# EAGLE design DBPIC16f887_V2 (EAGLE 9.6.2)
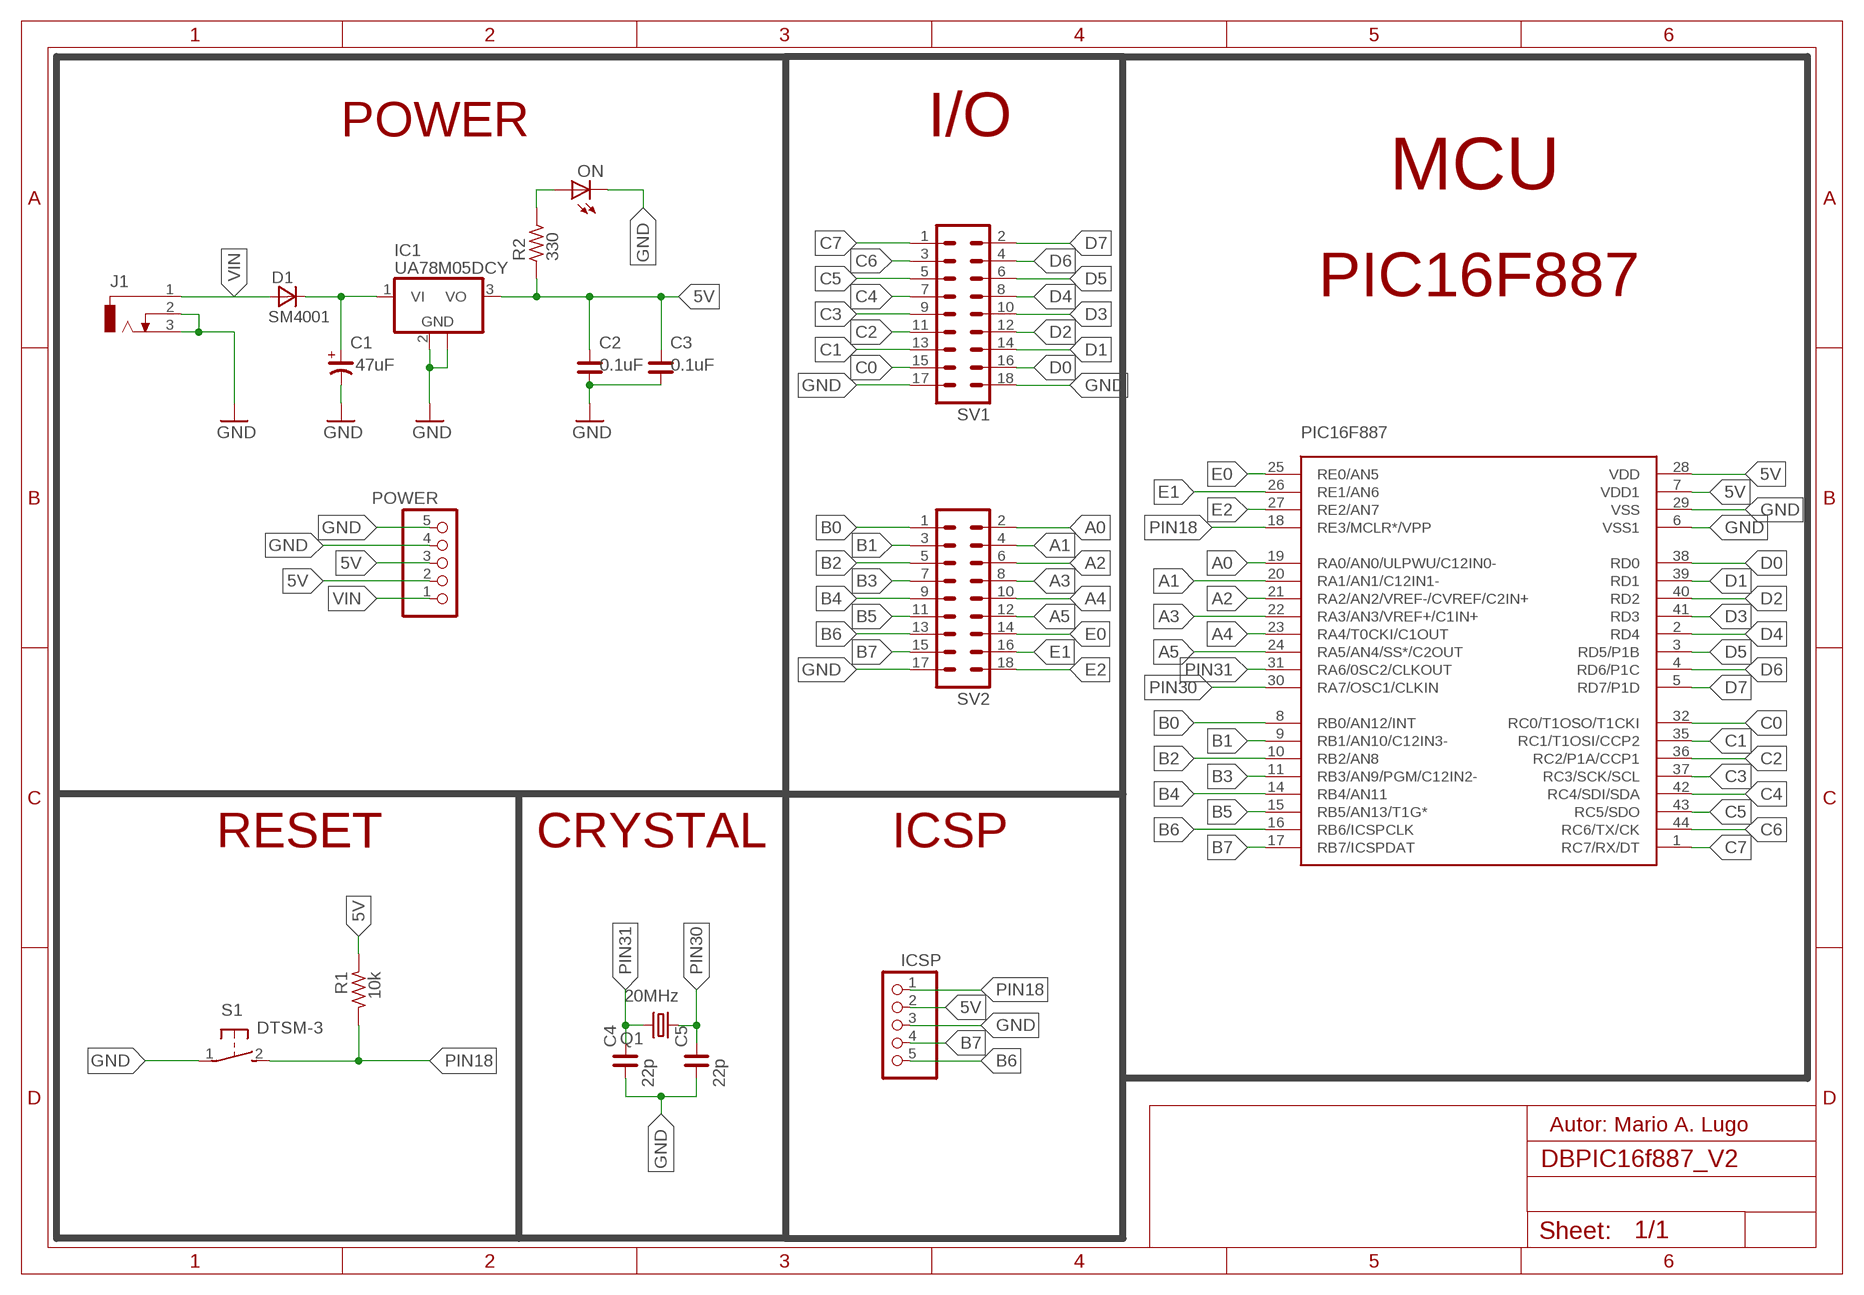
[diagram p0: schematic, sheet 1]

## Parts
C1  47uF  CP_SV-B  [CSV-B]
C2  0.1uF  C_0805  [C0805]
C3  0.1uF  C_0805  [C0805]
C4  22p  C_0805  [C0805]
C5  22p  C_0805  [C0805]
D1  SM4001  [MELF-MLL41]
IC1  UA78M05DCY  [SOT223]
ICSP  PINHD-1X5  [1X05]
J1  DCJ0303  [DCJ0303]
MCU  PIC16F887  [TQFP44]
ON  LEDCHIPLED_0805  [CHIPLED_0805]
POWER  PINHD-1X5  [1X05]
Q1  20MHz  CSM-7X-DU  [CSM-7X-DU]
R1  10k  R_0805  [R0805]
R2  330  R_0805  [R0805]
S1  DTSM-3  [DTSM-3]
SV1  MA09-2  [MA09-2]
SV2  MA09-2  [MA09-2]

## Nets
5V: C2.2 C3.2 IC1.3(VO) ICSP.2 MCU.7(VDD1) MCU.28(VDD) POWER.2 POWER.3 R1.1 R2.1
A0: MCU.19(RA0/AN0/ULPWU/C12IN0-) SV2.2
A1: MCU.20(RA1/AN1/C12IN1-) SV2.4
A2: MCU.21(RA2/AN2/VREF-/CVREF/C2IN+) SV2.6
A3: MCU.22(RA3/AN3/VREF+/C1IN+) SV2.8
A4: MCU.23(RA4/T0CKI/C1OUT) SV2.10
A5: MCU.24(RA5/AN4/SS*/C2OUT) SV2.12
B0: MCU.8(RB0/AN12/INT) SV2.1
B1: MCU.9(RB1/AN10/C12IN3-) SV2.3
B2: MCU.10(RB2/AN8) SV2.5
B3: MCU.11(RB3/AN9/PGM/C12IN2-) SV2.7
B4: MCU.14(RB4/AN11) SV2.9
B5: MCU.15(RB5/AN13/T1G*) SV2.11
B6: ICSP.5 MCU.16(RB6/ICSPCLK) SV2.13
B7: ICSP.4 MCU.17(RB7/ICSPDAT) SV2.15
C0: MCU.32(RC0/T1OSO/T1CKI) SV1.15
C1: MCU.35(RC1/T1OSI/CCP2) SV1.13
C2: MCU.36(RC2/P1A/CCP1) SV1.11
C3: MCU.37(RC3/SCK/SCL) SV1.9
C4: MCU.42(RC4/SDI/SDA) SV1.7
C5: MCU.43(RC5/SDO) SV1.5
C6: MCU.44(RC6/TX/CK) SV1.3
C7: MCU.1(RC7/RX/DT) SV1.1
D0: MCU.38(RD0) SV1.16
D1: MCU.39(RD1) SV1.14
D2: MCU.40(RD2) SV1.12
D3: MCU.41(RD3) SV1.10
D4: MCU.2(RD4) SV1.8
D5: MCU.3(RD5/P1B) SV1.6
D6: MCU.4(RD6/P1C) SV1.4
D7: MCU.5(RD7/P1D) SV1.2
E0: MCU.25(RE0/AN5) SV2.14
E1: MCU.26(RE1/AN6) SV2.16
E2: MCU.27(RE2/AN7) SV2.18
GND: C1.- C2.1 C3.1 C4.1 C5.1 IC1.2(GND) IC1.4(GND) ICSP.3 J1.2 J1.3 MCU.6(VSS1) MCU.29(VSS) ON.C POWER.4 POWER.5 S1.1 SV1.17 SV1.18 SV2.17
LED1: ON.A R2.2
PIN18: ICSP.1 MCU.18(RE3/MCLR*/VPP) R1.2 S1.2
PIN30: C5.2 MCU.30(RA7/OSC1/CLKIN) Q1.1
PIN31: C4.2 MCU.31(RA6/0SC2/CLKOUT) Q1.2
VI: C1.+ D1.C IC1.1(VI)
VIN: D1.A J1.1 POWER.1

## Notes on the sheet
- POWER | I/O
- MCU
- PIC16F887
- RESET | CRYSTAL | ICSP
- Autor: Mario A. Lugo

## Library data of the parts
C1 = rc-master-smd:CP_: POLARIZED CAP
C2-C5 = rc-master-smd:C_: NON-POLARIZED CAP
D1 = _mod_diode:SM400*: SM4001 .. SM4007 General Purpose Rectifier, 1 A SMD-Version of 1N4001 .. 1N4007 Case: MELF-MLL41 = DO 213 AB Author: Dipl.-Ing. FH Rainer Bayer HHN Hochschule Heilbronn, rainer.bayer@hs-heilbronn.de Ingenieurbüro ing-rb, mail@ing-rb.de
IC1 = linear:UA78M*: POSITIVE-VOLTAGE REGULATORS Source: http://focus.ti.com/lit/ds/symlink/ua78m33.pdf
ICSP POWER = pinhead:PINHD-1X5: PIN HEADER
J1 = con-jack:DCJ0303: DC POWER JACK Source: DCJ0303.pdf
MCU = pic16f88x-v0.1:PIC16F887
ON = led:LED: LED OSRAM: - CHIPLED LG R971, LG N971, LY N971, LG Q971, LY Q971, LO R971, LY R971 LH N974, LH R974 LS Q976, LO Q976, LY Q976 LO Q996 - Hyper CHIPLED LW Q18S LB Q993, LB Q99A, LB R99A - SideLED LS A670, LO A670, LY A670, LG A670, LP A670 LB A673, LV A673, LT A673, LW A673 LH A674 LY A675 LS A676, LA A676, LO A676, LY A676, LW A676 LS A679, LY A679, LG A679 - Hyper Micro SIDELED® LS Y876, LA Y876, LO Y876, LY Y876 LT Y87S - SmartLED LW L88C, LW L88S LB L89C, LB L89S, LG L890 LS L89K, LO L89K, LY L89K LS L896, LA L896, LO L896, LY L896 - TOPLED LS T670, LO T670, LY T670, LG T670, LP T670 LSG T670, LSP T670, LSY T670, LOP T670, LYG T670 LG T671, LOG T671, LSG T671 LB T673, LV T673, LT T673, LW T673 LH T674 LS T676, LA T676, LO T676, LY T676, LB T676, LH T676, LSB T676, LW T676 LB T67C, LV T67C, LT T67C, LS T67K, LO T67K, LY T67K, LW E67C LS E67B, LA E67B, LO E67B, LY E67B, LB E67C, LV E67C, LT E67C LW T67C LS T679, LY T679, LG T679 LS T770, LO T770, LY T770, LG T770, LP T770 LB T773, LV T773, LT T773, LW T773 LH T774 LS E675, LA E675, LY E675, LS T675 LS T776, LA T776, LO T776, LY T776, LB T776 LHGB T686 LT T68C, LB T68C - Hyper Mini TOPLED® LB M676 - Mini TOPLED Santana® LG M470 LS M47K, LO M47K, LY M47K Source: http://www.osram.convergy.de LUXEON: - LUMILED® LXK2-PW12-R00, LXK2-PW12-S00, LXK2-PW14-U00, LXK2-PW14-V00 LXK2-PM12-R00, LXK2-PM12-S00, LXK2-PM14-U00 LXK2-PE12-Q00, LXK2-PE12-R00, LXK2-PE12-S00, LXK2-PE14-T00, LXK2-PE14-U00 LXK2-PB12-K00, LXK2-PB12-L00, LXK2-PB12-M00, LXK2-PB14-N00, LXK2-PB14-P00, LXK2-PB14-Q00 LXK2-PR12-L00, LXK2-PR12-M00, LXK2-PR14-Q00, LXK2-PR14-R00 LXK2-PD12-Q00, LXK2-PD12-R00, LXK2-PD12-S00 LXK2-PH12-R00, LXK2-PH12-S00 LXK2-PL12-P00, LXK2-PL12-Q00, LXK2-PL12-R00 Source: www.luxeon.com KINGBRIGHT: KA-3528ASYC Source: www.kingbright.com
Q1 = crystal(MOD):CSM-7X-DU: SMD CRYSTAL Source: www.ecsxtal.com .. Crystal 3.6864MHz CSM_7X_DU.PDF; OC_FARNELL: unknown; OC_NEWARK: unknown
R1 R2 = rc-master-smd:R_: RESISTOR
S1 = switch-tact:DTSM-3
SV1 SV2 = con-header-macho(mod):MA09-2: PIN HEADER; OC_FARNELL: unknown; OC_NEWARK: unknown

## Module IS
Ports: 

### Library data of the parts

## Board
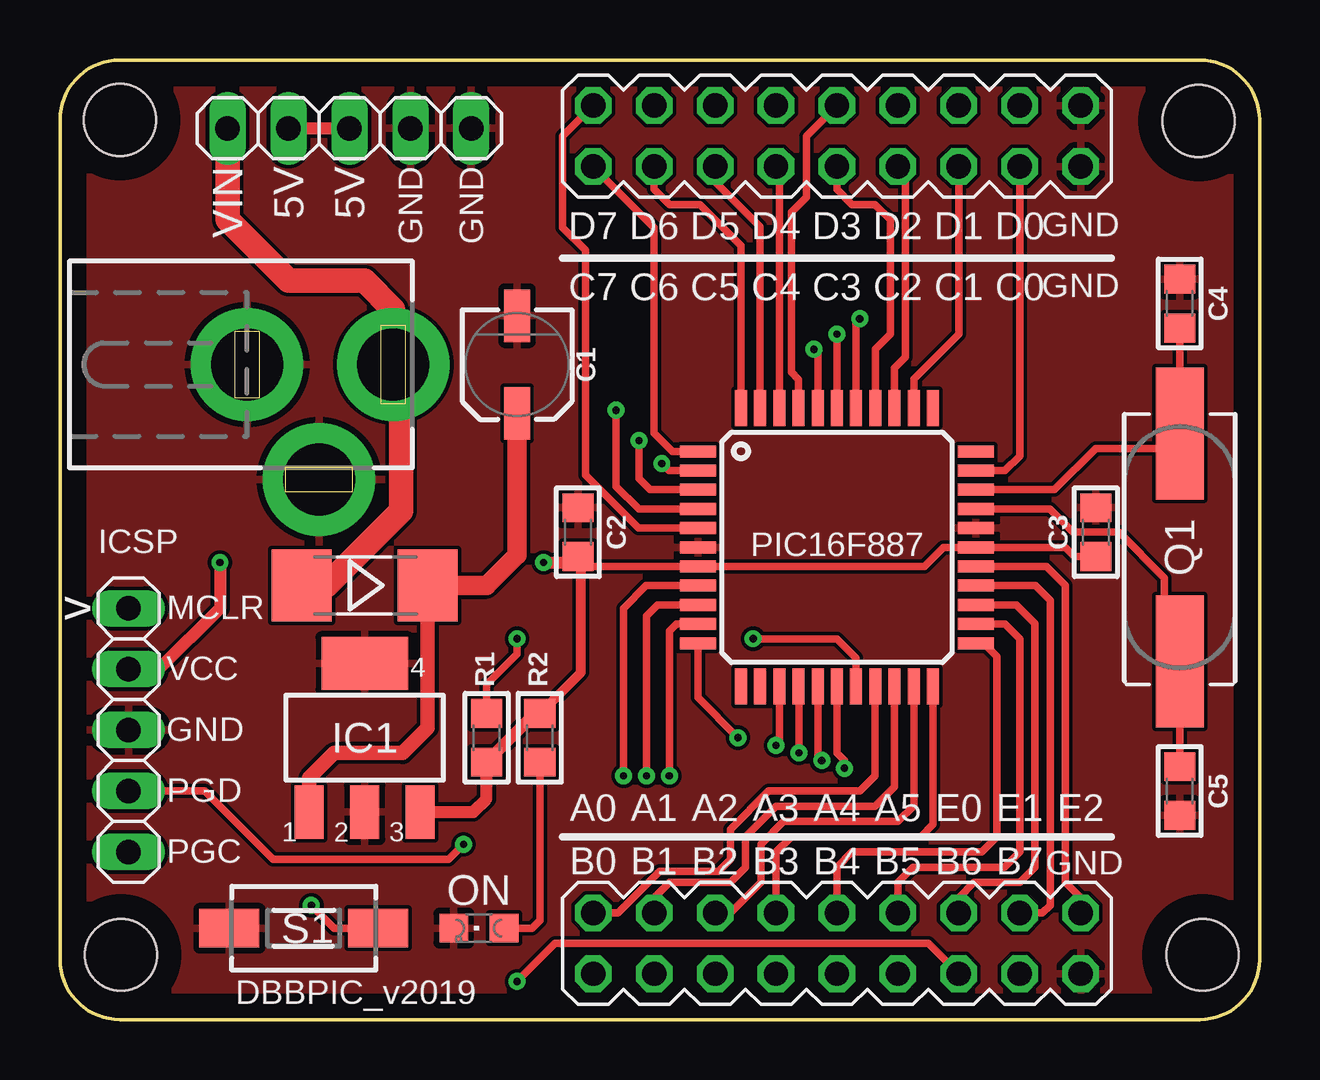
[diagram p1: board, top side]
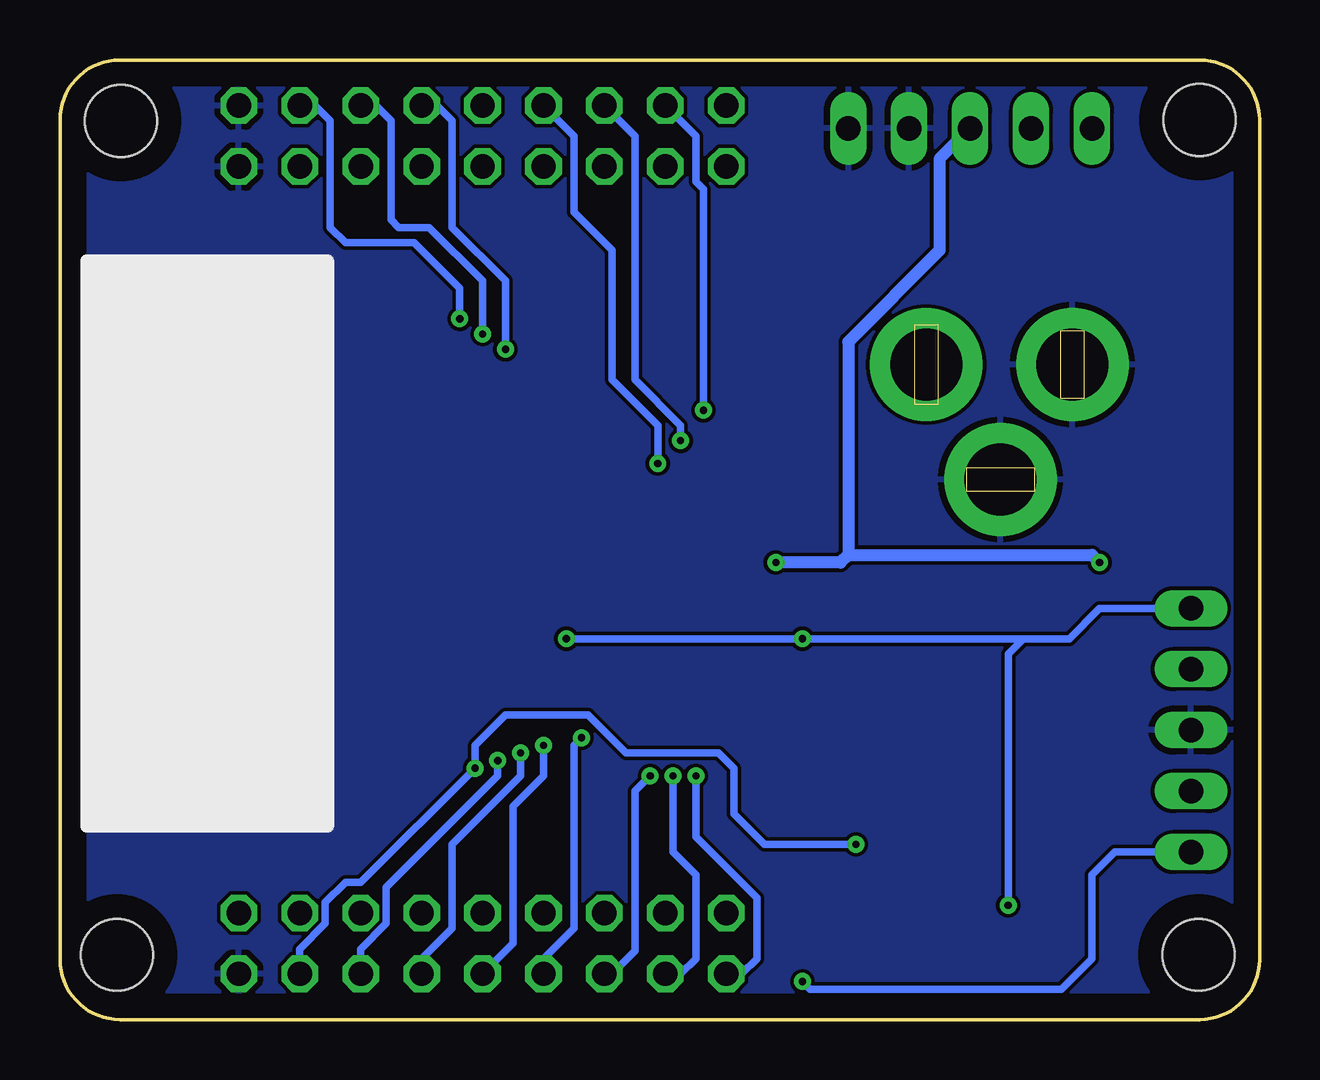
[diagram p2: board, bottom side, seen from below]

Size 50 x 40 mm. Coordinates in mm from the lower left corner, seen from the top.
Outline: 50,37.5 50,2.5 arc-90 47.5,0 2.5,0 arc-90 0,2.5 0,37.5 arc-90 2.5,40 47.5,40 arc-90 50,37.5
Copper layers (1*16): Top 0.035mm / dielectric 1.5mm / Bottom 0.035mm
Design rules "DRC JLCPCB": minimum track width 6mil, minimum drill 0.2mm, track to track 6mil, track to pad 6mil, pad to pad 6mil, via to via 6mil, smd to smd 6mil, copper to edge 40mil, drill to drill 6mil, minimum pad ring 10mil, minimum via ring 8mil, stop-mask expansion 4mil, vias tented up to drill 0mil, thermal gap 10mil
Holes 3 mm at 2.5,37.5 47.47,37.47 47.62,2.7 2.54,2.7

### Footprints (pad centres in the part's own frame; a part is rotated, then mirrored left to right if it is on the bottom)
CSV-B = smd 2.184 x 1.067: + -2.032,0; - 2.032,0
C0805 = smd 1.2 x 1.3: 1 -1.016,0; 2 1.016,0
MELF-MLL41 = smd 2.5 x 3: A 2.625,0; C -2.625,0
SOT223 = smd 1.219 x 2.235: 1 -2.311,-3.099; 2 0,-3.099; 3 2.311,-3.099 | smd 3.6 x 2.2: 4 0,3.099
1X05 = drill 1.016 long: 1 -5.08,0; 2 -2.54,0; 3 0,0; 4 2.54,0; 5 5.08,0
DCJ0303 = drill 3 pad 4.7: 1 0,3.1; 2 4.8,0; 3 0,-3
TQFP44 = smd 1.5 x 0.5: 1 -5.8,4; 2 -5.8,3.2; 3 -5.8,2.4; 4 -5.8,1.6; 5 -5.8,0.8; 6 -5.8,0; 7 -5.8,-0.8; 8 -5.8,-1.6; 9 -5.8,-2.4; 10 -5.8,-3.2; 11 -5.8,-4; 23 5.8,-4; 24 5.8,-3.2; 25 5.8,-2.4; 26 5.8,-1.6; 27 5.8,-0.8; 28 5.8,0; 29 5.8,0.8; 30 5.8,1.6; 31 5.8,2.4; 32 5.8,3.2; 33 5.8,4 | smd 0.5 x 1.5: 12 -4,-5.8; 13 -3.2,-5.8; 14 -2.4,-5.8; 15 -1.6,-5.8; 16 -0.8,-5.8; 17 0,-5.8; 18 0.8,-5.8; 19 1.6,-5.8; 20 2.4,-5.8; 21 3.2,-5.8; 22 4,-5.8; 34 4,5.8; 35 3.2,5.8; 36 2.4,5.8; 37 1.6,5.8; 38 0.8,5.8; 39 0,5.8; 40 -0.8,5.8; 41 -1.6,5.8; 42 -2.4,5.8; 43 -3.2,5.8; 44 -4,5.8
CHIPLED_0805 = smd 1.2 x 1.2: A 0,-1.05; C 0,1.05
CSM-7X-DU = smd 5.5 x 2: 1 -4.75,0; 2 4.75,0
R0805 = smd 1.2 x 1.3: 1 -1.016,0; 2 1.016,0
DTSM-3 = smd 2.5 x 1.6: 1 -3.1,0; 2 3.1,0
MA09-2 = drill 1.016 octagon: 1 -10.16,-1.27; 2 -10.16,1.27; 3 -7.62,-1.27; 4 -7.62,1.27; 5 -5.08,-1.27; 6 -5.08,1.27; 7 -2.54,-1.27; 8 -2.54,1.27; 9 0,-1.27; 10 0,1.27; 11 2.54,-1.27; 12 2.54,1.27; 13 5.08,-1.27; 14 5.08,1.27; 15 7.62,-1.27; 16 7.62,1.27; 17 10.16,-1.27; 18 10.16,1.27

### Placement (x,y rotation side)
C1  19.05,27.3 90 top
C2  21.59,20.32 270 top
C3  43.18,20.32 270 top
C4  46.67,29.84 270 top
C5  46.67,9.53 90 top
D1  12.7,18.1 180 top
IC1  12.7,11.75 0 top
ICSP  2.86,12.06 270 top
J1  10.79,27.3 270 top
MCU  32.38,19.68 0 top
ON  17.46,3.81 90 top
POWER  12.06,37.15 0 top
Q1  46.67,19.68 90 top
R1  17.78,11.75 90 top
R2  20,11.75 270 top
S1  10.16,3.81 0 top
SV1  32.38,36.83 0 top
SV2  32.38,3.17 0 top

### Tracks (layer width: path | path; a pad name or v marks a point on that pad's centre or on a via)
5V  (via drill 0.3 pad 0.6)
  Top 0.305: C3.2 42.29,19.3 41.91,19.68 MCU.28 36.83,19.68 36.03,18.89 MCU.7 22.01,18.89 21.72,19.18 C2.2
  Top 0.406: R2.1 21.72,14.48 21.72,19.05 21.72,19.18
  Top 0.508: IC1.3 17.22,8.65 17.78,9.21 R1.1 19.81,12.76 R2.1 | POWER.2 POWER.3 | v20.16,19.05 21.72,19.05 | v6.67,19.05 6.67,17.14 4.13,14.61 ICSP.2
  Bottom 0.508: POWER.3 13.34,35.88 13.34,32.07 17.14,28.26 17.14,19.37 | 17.14,19.37 17.46,19.05 v20.16,19.05 | 17.14,19.37 6.99,19.37 v6.67,19.05
A0
  Top 0.305: MCU.19 33.97,10.16 33.34,9.53 29.53,9.53 27.94,7.94 27.94,6.67 27.45,6.17 24.98,6.17 23.26,4.45 SV2.2
A1
  Top 0.305: MCU.20 34.78,9.7 33.97,8.89 29.84,8.89 28.57,7.62 28.57,6.35 27.94,5.71 25.4,5.71 24.77,5.08 SV2.4
A2
  Top 0.305: MCU.21 35.59,8.91 34.92,8.26 30.16,8.26 29.21,7.3 29.21,5.71 27.94,4.45 SV2.6
A3
  Top 0.305: MCU.22 36.38,8.13 35.88,7.62 30.48,7.62 29.84,6.99 SV2.8
A4
  Top 0.305: MCU.23 38.5,15.69 39.05,15.13 39.05,7.62 38.42,6.99 33.02,6.99 32.38,6.35 SV2.10
A5
  Top 0.305: MCU.24 39.4,16.48 40.01,15.88 40.01,6.99 39.37,6.35 35.56,6.35 34.92,5.71 SV2.12
B0  (via drill 0.3 pad 0.6)
  Top 0.305: MCU.8 24.43,18.09 23.5,17.14 v23.5,10.16
  Bottom 0.305: v23.5,10.16 23.5,7.62 20.95,5.08 20.95,2.54 21.59,1.91 SV2.1
B1  (via drill 0.3 pad 0.6)
  Top 0.305: MCU.9 24.91,17.29 24.45,16.83 v24.45,10.16
  Bottom 0.305: SV2.3 24.13,1.91 23.5,2.54 23.5,6.03 24.45,6.99 v24.45,10.16
B2  (via drill 0.3 pad 0.6)
  Top 0.305: MCU.10 25.69,16.48 25.4,16.19 v25.4,10.16
  Bottom 0.305: v25.4,10.16 26.04,9.53 26.04,2.86 26.99,1.91 SV2.5
B3  (via drill 0.3 pad 0.6)
  Top 0.305: MCU.11 26.59,13.42 v28.26,11.75
  Bottom 0.305: v28.26,11.75 28.57,11.43 28.57,3.81 29.84,2.54 SV2.7
B4  (via drill 0.3 pad 0.6)
  Top 0.305: MCU.14 29.98,11.57 v29.84,11.43
  Bottom 0.305: v29.84,11.43 29.84,10.16 31.11,8.89 31.11,3.17 SV2.9
B5  (via drill 0.3 pad 0.6)
  Top 0.305: MCU.15 30.8,13.87 v30.8,11.11
  Bottom 0.305: v30.8,11.11 30.8,10.16 33.66,7.3 33.66,3.81 34.92,2.54 SV2.11
B6  (via drill 0.3 pad 0.6)
  Top 0.305: MCU.16 31.59,10.96 v31.75,10.79 | SV2.13 36.2,3.17 21.27,3.17 20.95,3.17 20.64,3.17 v19.05,1.59
  Bottom 0.305: v31.75,10.79 31.75,10.16 36.4,5.51 36.4,4 37.47,2.94 SV2.13 | ICSP.5 6.03,6.99 6.99,6.03 6.99,2.54 8.26,1.27 18.73,1.27 v19.05,1.59
B7  (via drill 0.3 pad 0.6)
  Top 0.305: MCU.17 32.38,11.11 32.7,10.79 v32.7,10.48 | ICSP.4 6.03,9.53 8.89,6.67 16.19,6.67 v16.83,7.3
  Bottom 0.305: SV2.15 40.01,2.94 38.94,4 38.94,4.88 38.1,5.71 37.47,5.71 v32.7,10.48 32.7,11.43 31.43,12.7 28,12.7 26.41,11.11 22.54,11.11 21.91,10.48 21.91,8.57 20.64,7.3 v16.83,7.3
C0
  Top 0.305: MCU.32 39.4,22.89 40.01,23.5 SV1.15
C1
  Top 0.305: MCU.35 35.59,26.7 37.47,28.57 SV1.13
C2
  Top 0.305: MCU.36 34.78,27.16 35.24,27.62 35.24,35.24 SV1.11
C3
  Top 0.305: MCU.37 33.98,27.95 34.61,28.57 34.61,33.34 33.97,33.97 33.02,33.97 32.38,34.61 SV1.9
C4
  Top 0.305: MCU.42 29.98,35.42 SV1.7
C5
  Top 0.305: MCU.43 29.18,33.05 27.3,34.92 SV1.5
C6
  Top 0.305: MCU.44 28.39,32.26 26.67,33.97 25.4,33.97 24.77,34.61 SV1.3
C7
  Top 0.305: MCU.1 25.53,23.68 24.77,24.45 24.77,33.02 SV1.1
D0  (via drill 0.3 pad 0.6)
  Top 0.305: MCU.38 33.19,29.06 v33.34,29.21
  Bottom 0.305: v33.34,29.21 33.34,30.48 35.24,32.38 38.1,32.38 38.73,33.02 38.73,37.47 39.37,38.1 SV1.16
D1  (via drill 0.3 pad 0.6)
  Top 0.305: MCU.39 v32.38,28.57
  Bottom 0.305: v32.38,28.57 32.38,30.8 34.61,33.02 35.88,33.02 36.2,33.34 36.2,37.47 36.83,38.1 SV1.14
D2  (via drill 0.3 pad 0.6)
  Top 0.305: MCU.40 31.59,27.79 v31.43,27.94
  Bottom 0.305: v31.43,27.94 31.43,30.8 33.66,33.02 33.66,37.47 34.29,38.1 SV1.12
D3
  Top 0.305: SV1.10 31.11,36.83 31.11,34.29 30.48,33.66 30.48,26.99 30.79,26.68 MCU.41
D4  (via drill 0.3 pad 0.6)
  Top 0.305: MCU.2 25.38,22.89 v25.08,23.18
  Bottom 0.305: SV1.8 28.57,36.83 28.57,33.66 26.99,32.07 26.99,26.67 25.08,24.77 v25.08,23.18
D5  (via drill 0.3 pad 0.6)
  Top 0.305: v24.13,24.13 24.13,22.54 24.59,22.09 MCU.3
  Bottom 0.305: SV1.6 26.04,36.83 26.04,26.67 24.13,24.77 v24.13,24.13
D6  (via drill 0.3 pad 0.6)
  Top 0.305: MCU.4 24.14,21.29 24.13,21.27 23.18,22.23 v23.18,25.4
  Bottom 0.305: SV1.4 23.5,36.83 23.5,34.92 23.18,34.61 v23.18,25.4
D7
  Top 0.305: SV1.2 20.95,36.83 20.95,33.02 21.91,32.07 21.91,22.7 24.12,20.48 MCU.5
E0
  Top 0.305: MCU.25 39.87,17.29 40.64,16.51 40.64,6.35 40.01,5.71 38.1,5.71 37.47,5.08 SV2.14
E1
  Top 0.305: MCU.26 40.65,18.09 41.27,17.46 41.27,4.76 40.96,4.45 SV2.16
E2
  Top 0.305: MCU.27 41.12,18.89 41.91,18.1 41.91,5.71 42.55,5.08 SV2.18
GND
  pour Top (isolate 0.152): 0,40 50,40 50,0 0,0
  pour Bottom (isolate 0.152): 0,40 50,40 50,0 0,0
LED1
  Top 0.305: ON.A 19.68,3.81 20,4.13 R2.2
PIN18  (via drill 0.3 pad 0.6)
  Top 0.305: MCU.18 33.19,15.07 32.38,15.88 v28.89,15.88 | R1.2 17.78,13.97 19.05,15.24 v19.05,15.88 | S1.2 11.43,3.81 v10.48,4.76
  Bottom 0.305: v28.89,15.88 v19.05,15.88 9.84,15.88 | ICSP.1 6.67,17.14 7.94,15.88 9.84,15.88 | 9.84,15.88 10.48,15.24 v10.48,4.76
PIN30
  Top 0.305: MCU.30 41.26,21.29 42.23,20.32 44.13,20.32 46.04,18.41 46.04,15.24 46.34,14.94 Q1.1 C5.2
PIN31
  Top 0.305: MCU.31 41.45,22.09 43.18,23.81 46.05,23.81 Q1.2 C4.2
VI
  Top 0.61: D1.C 15.32,12.15 14.29,11.11 11.43,11.11 10.39,10.07 IC1.1
  Top 0.813: D1.C 17.78,18.1 19.05,19.37 C1.+
VIN
  Top 0.813: 11.11,18.1 D1.A
  Top 1.016: POWER.1 6.99,33.34 9.53,30.8 12.7,30.8 13.89,29.6 J1.1 14.21,27.3 14.21,21.2 11.11,18.1

### Text on the board
tPlace: VIN | 5V | 5V | GND | GND | D7 | D6 | D5 | D4 | D3 | D2 | D1 | D0 | GND | C7 | C6 | C5 | C4 | C3 | C2 | C1 | C0 | GND | PIC16F887 | v | MCLR | VCC | GND | PGD | A0 | A1 | A2 | A3 | A4 | A5 | E0 | E1 | E2 | PGC | B0 | B1 | B2 | B3 | B4 | B5 | B6 | B7 | GND | DBBPIC_v2019